# EAGLE schematic riffle-proto-0.1 (EAGLE 7.3.0)
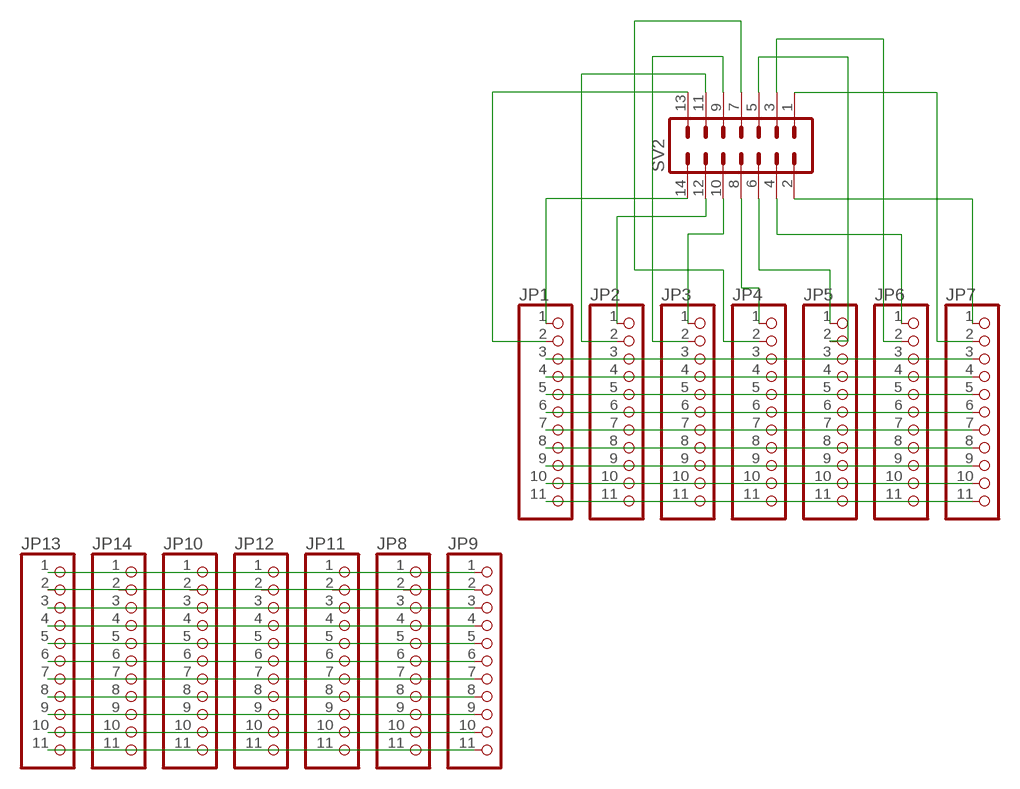
[diagram p0: schematic, sheet 1]

## Parts
JP1  HEADER-1X1176MIL  [1X11_ROUND_76]
JP2  HEADER-1X1176MIL  [1X11_ROUND_76]
JP3  HEADER-1X1176MIL  [1X11_ROUND_76]
JP4  HEADER-1X1176MIL  [1X11_ROUND_76]
JP5  HEADER-1X1176MIL  [1X11_ROUND_76]
JP6  HEADER-1X1176MIL  [1X11_ROUND_76]
JP7  HEADER-1X1176MIL  [1X11_ROUND_76]
JP8  HEADER-1X1176MIL  [1X11_ROUND_76]
JP9  HEADER-1X1176MIL  [1X11_ROUND_76]
JP10  HEADER-1X1176MIL  [1X11_ROUND_76]
JP11  HEADER-1X1176MIL  [1X11_ROUND_76]
JP12  HEADER-1X1176MIL  [1X11_ROUND_76]
JP13  HEADER-1X1176MIL  [1X11_ROUND_76]
JP14  HEADER-1X1176MIL  [1X11_ROUND_76]
SV2  MA07-2  [MA07-2]

## Nets
N$1: JP1.1 SV2.14
N$2: JP2.1 SV2.12
N$3: JP3.1 SV2.10
N$4: JP4.1 SV2.8
N$5: JP5.1 SV2.6
N$6: JP6.1 SV2.4
N$7: JP7.1 SV2.2
N$8: JP1.2 SV2.13
N$9: JP2.2 SV2.11
N$10: JP3.2 SV2.9
N$11: JP4.2 SV2.7
N$12: JP5.2 SV2.5
N$13: JP6.2 SV2.3
N$14: JP7.2 SV2.1
N$15: JP1.3 JP2.3 JP3.3 JP4.3 JP5.3 JP6.3 JP7.3
N$16: JP1.4 JP2.4 JP3.4 JP4.4 JP5.4 JP6.4 JP7.4
N$17: JP1.5 JP2.5 JP3.5 JP4.5 JP5.5 JP6.5 JP7.5
N$18: JP1.6 JP2.6 JP3.6 JP4.6 JP5.6 JP6.6 JP7.6
N$19: JP1.7 JP2.7 JP3.7 JP4.7 JP5.7 JP6.7 JP7.7
N$20: JP1.8 JP2.8 JP3.8 JP4.8 JP5.8 JP6.8 JP7.8
N$21: JP1.9 JP2.9 JP3.9 JP4.9 JP5.9 JP6.9 JP7.9
N$22: JP1.10 JP2.10 JP3.10 JP4.10 JP5.10 JP6.10 JP7.10
N$23: JP1.11 JP2.11 JP4.11 JP5.11 JP6.11 JP7.11
N$24: JP8.1 JP9.1 JP10.1 JP11.1 JP12.1 JP13.1 JP14.1
N$25: JP8.2 JP9.2 JP10.2 JP11.2 JP12.2 JP13.2 JP14.2
N$38: JP8.3 JP9.3 JP10.3 JP11.3 JP12.3 JP13.3 JP14.3
N$39: JP8.4 JP9.4 JP10.4 JP11.4 JP12.4 JP13.4 JP14.4
N$40: JP8.5 JP9.5 JP10.5 JP11.5 JP12.5 JP13.5 JP14.5
N$41: JP8.6 JP9.6 JP10.6 JP11.6 JP12.6 JP13.6 JP14.6
N$42: JP8.7 JP9.7 JP10.7 JP11.7 JP12.7 JP13.7 JP14.7
N$43: JP8.8 JP9.8 JP10.8 JP11.8 JP12.8 JP13.8 JP14.8
N$44: JP8.9 JP9.9 JP10.9 JP11.9 JP12.9 JP13.9 JP14.9
N$45: JP8.10 JP9.10 JP10.10 JP11.10 JP12.10 JP13.10 JP14.10
N$46: JP8.11 JP9.11 JP11.11 JP12.11 JP13.11 JP14.11
Unconnected: JP3.11 JP10.11

## Library data of the parts
JP1-JP14 = microbuilder:HEADER-1X11
SV2 = con-lstb:MA07-2: PIN HEADER; OC_FARNELL: unknown; OC_NEWARK: unknown